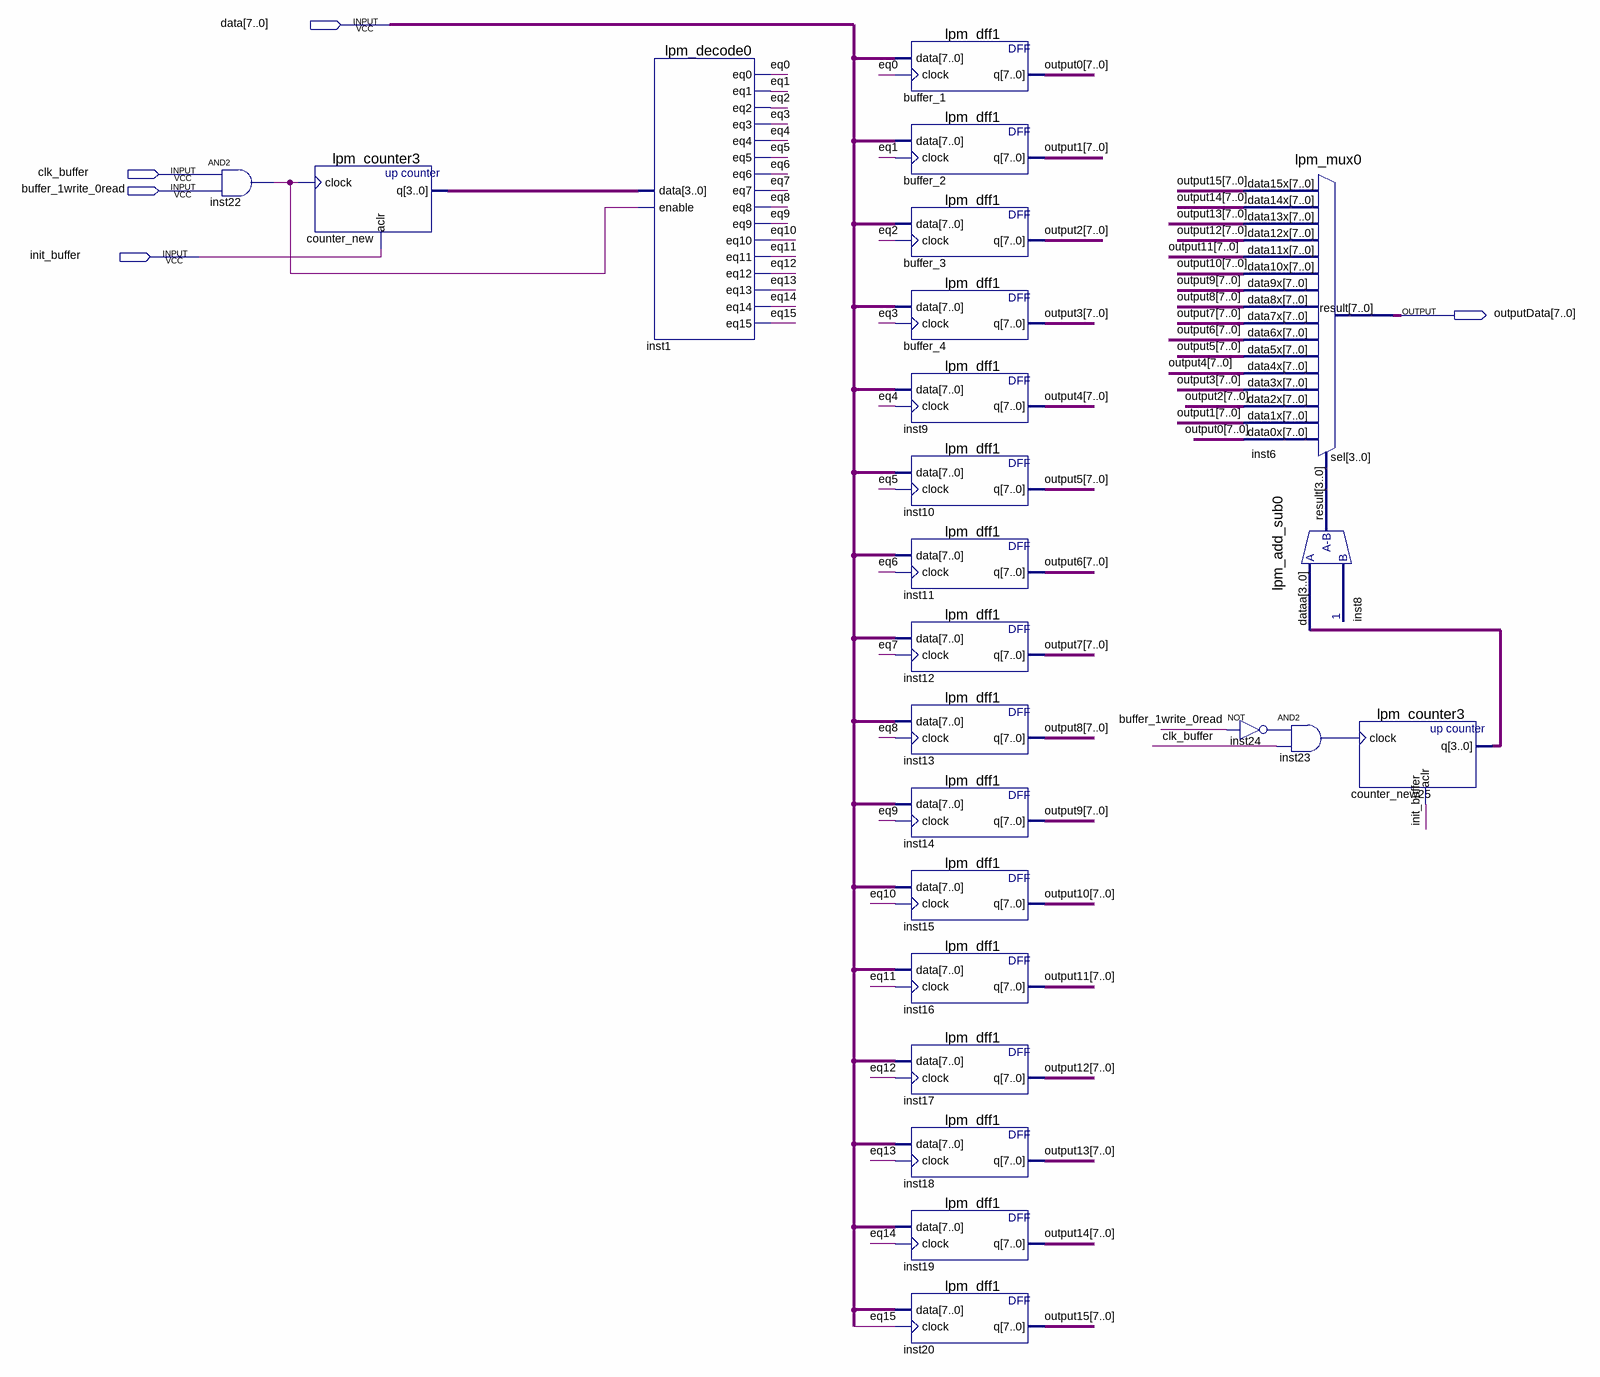
[diagram p0: schematic sheet]
// Quartus schematic Buffer.bdf as structural Verilog: 24 symbols, 5 pins
module Buffer (
  input  [7:0] data,
  input  clk_buffer,
  input  buffer_1write_0read,
  input  init_buffer,
  output [7:0] outputData
);

  wire eq0, eq1, eq2, eq3, eq4, eq5, eq6, eq7, eq8, eq9, eq10, eq11, eq12, eq13, eq14, eq15, inst22_out,
       inst23_out, inst24_out;
  wire [3:0] counter_new25_q, counter_new_q, inst8_result;
  wire [7:0] output0, output1, output2, output3, output4, output5, output6, output7, output8, output9,
       output10, output11, output12, output13, output14, output15;

  and inst22 (inst22_out, clk_buffer, buffer_1write_0read);
  lpm_counter3 counter_new (.clock(inst22_out), .aclr(init_buffer), .q(counter_new_q));
  lpm_decode0 inst1 (
    .data(counter_new_q), .enable(inst22_out), .eq0(eq0), .eq1(eq1), .eq2(eq2), .eq3(eq3), .eq4(eq4),
    .eq5(eq5), .eq6(eq6), .eq7(eq7), .eq8(eq8), .eq9(eq9), .eq10(eq10), .eq11(eq11), .eq12(eq12),
    .eq13(eq13), .eq14(eq14), .eq15(eq15));
  lpm_dff1 buffer_1 (.data(data), .clock(eq0), .q(output0));
  lpm_dff1 buffer_2 (.data(data), .clock(eq1), .q(output1));
  lpm_dff1 buffer_3 (.data(data), .clock(eq2), .q(output2));
  lpm_dff1 buffer_4 (.data(data), .clock(eq3), .q(output3));
  lpm_dff1 inst9 (.data(data), .clock(eq4), .q(output4));
  lpm_dff1 inst10 (.data(data), .clock(eq5), .q(output5));
  lpm_dff1 inst11 (.data(data), .clock(eq6), .q(output6));
  lpm_dff1 inst12 (.data(data), .clock(eq7), .q(output7));
  lpm_dff1 inst13 (.data(data), .clock(eq8), .q(output8));
  lpm_dff1 inst14 (.data(data), .clock(eq9), .q(output9));
  lpm_dff1 inst15 (.data(data), .clock(eq10), .q(output10));
  lpm_dff1 inst16 (.data(data), .clock(eq11), .q(output11));
  lpm_dff1 inst17 (.data(data), .clock(eq12), .q(output12));
  lpm_dff1 inst18 (.data(data), .clock(eq13), .q(output13));
  lpm_dff1 inst19 (.data(data), .clock(eq14), .q(output14));
  lpm_dff1 inst20 (.data(data), .clock(eq15), .q(output15));
  lpm_mux0 inst6 (
    .data15x(output15), .data14x(output14), .data13x(output13), .data12x(output12), .data11x(output11),
    .data10x(output10), .data9x(output9), .data8x(output8), .data7x(output7), .data6x(output6),
    .data5x(output5), .data4x(output4), .data3x(output3), .data2x(output2), .data1x(output1),
    .data0x(output0), .sel(inst8_result), .result(outputData));
  lpm_add_sub0 inst8 (.dataa(counter_new25_q), .result(inst8_result));
  and inst23 (inst23_out, inst24_out, clk_buffer);
  not inst24 (inst24_out, buffer_1write_0read);
  lpm_counter3 counter_new25 (.clock(inst23_out), .aclr(init_buffer), .q(counter_new25_q));
endmodule
